# Altium schematic sheet 04-ModuleControls.SchDoc
size A
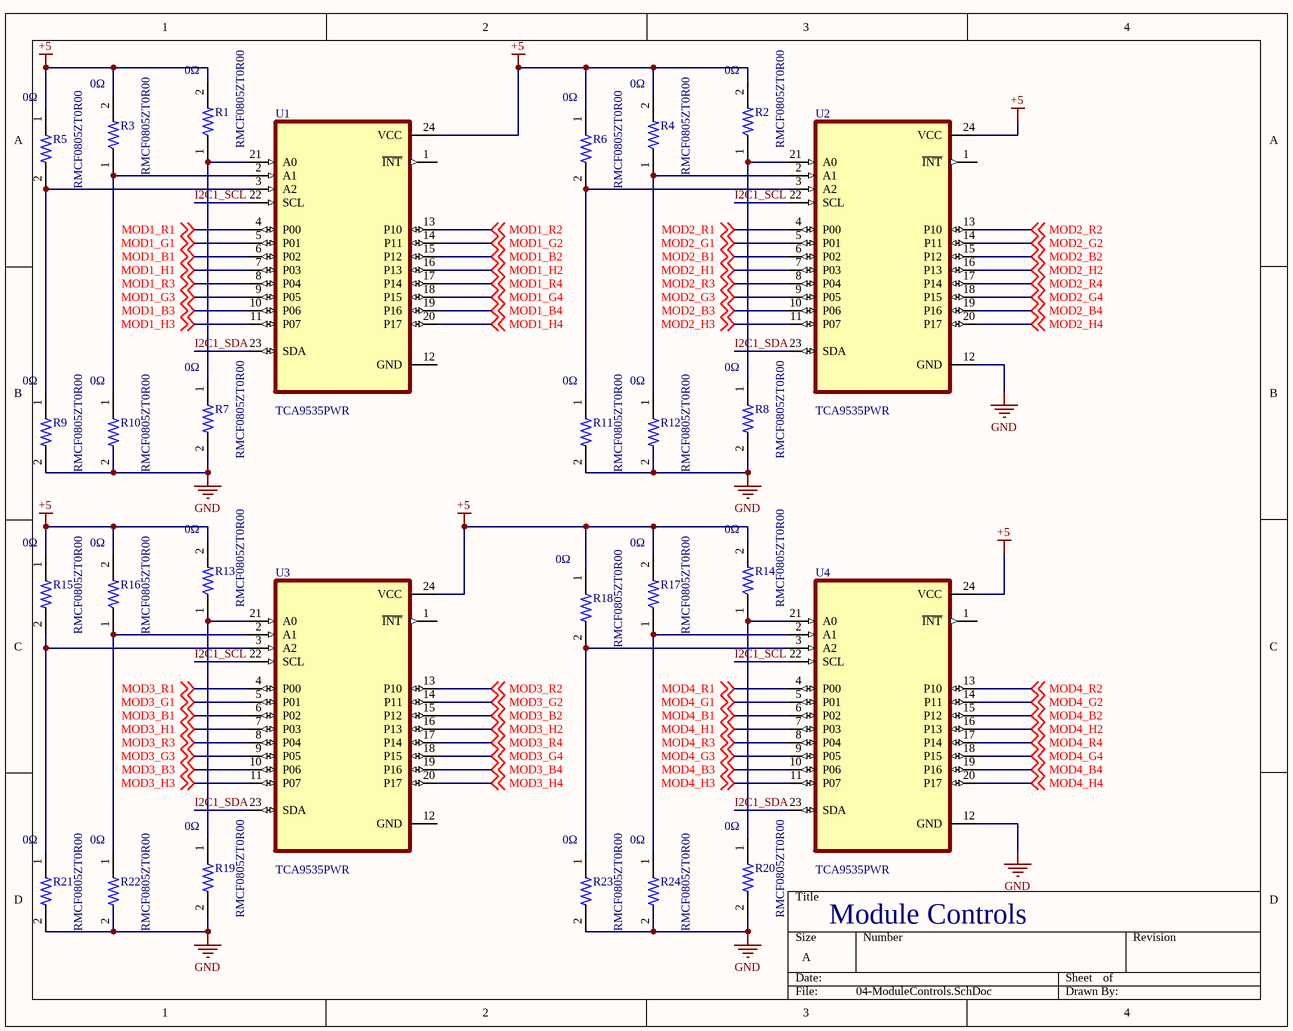
[diagram p0: 04-ModuleControls.SchDoc]

## Parts
R1  RMCF0805ZT0R00  Resitance: 0Ω  [RESC2012X60N]
R2  RMCF0805ZT0R00  Resitance: 0Ω  [RESC2012X60N]
R3  RMCF0805ZT0R00  Resitance: 0Ω  [RESC2012X60N]
R4  RMCF0805ZT0R00  Resitance: 0Ω  [RESC2012X60N]
R5  RMCF0805ZT0R00  Resitance: 0Ω  [RESC2012X60N]
R6  RMCF0805ZT0R00  Resitance: 0Ω  [RESC2012X60N]
R7  RMCF0805ZT0R00  Resitance: 0Ω  [RESC2012X60N]
R8  RMCF0805ZT0R00  Resitance: 0Ω  [RESC2012X60N]
R9  RMCF0805ZT0R00  Resitance: 0Ω  [RESC2012X60N]
R10  RMCF0805ZT0R00  Resitance: 0Ω  [RESC2012X60N]
R11  RMCF0805ZT0R00  Resitance: 0Ω  [RESC2012X60N]
R12  RMCF0805ZT0R00  Resitance: 0Ω  [RESC2012X60N]
R13  RMCF0805ZT0R00  Resitance: 0Ω  [RESC2012X60N]
R14  RMCF0805ZT0R00  Resitance: 0Ω  [RESC2012X60N]
R15  RMCF0805ZT0R00  Resitance: 0Ω  [RESC2012X60N]
R16  RMCF0805ZT0R00  Resitance: 0Ω  [RESC2012X60N]
R17  RMCF0805ZT0R00  Resitance: 0Ω  [RESC2012X60N]
R18  RMCF0805ZT0R00  Resitance: 0Ω  [RESC2012X60N]
R19  RMCF0805ZT0R00  Resitance: 0Ω  [RESC2012X60N]
R20  RMCF0805ZT0R00  Resitance: 0Ω  [RESC2012X60N]
R21  RMCF0805ZT0R00  Resitance: 0Ω  [RESC2012X60N]
R22  RMCF0805ZT0R00  Resitance: 0Ω  [RESC2012X60N]
R23  RMCF0805ZT0R00  Resitance: 0Ω  [RESC2012X60N]
R24  RMCF0805ZT0R00  Resitance: 0Ω  [RESC2012X60N]
U1  TCA9535PWR  [SOP65P640X120-24N]
U2  TCA9535PWR  [SOP65P640X120-24N]
U3  TCA9535PWR  [SOP65P640X120-24N]
U4  TCA9535PWR  [SOP65P640X120-24N]

## Nets
+5: R1.2 R2.2 R3.2 R4.2 R5.1 R6.1 R13.2 R14.2 R15.1 R16.2 R17.2 R18.1 U1.24(VCC) U2.24(VCC) U3.24(VCC) U4.24(VCC)
GND: R7.2 R8.2 R9.2 R10.2 R11.2 R12.2 R19.2 R20.2 R21.2 R22.2 R23.2 R24.2 U2.12(GND) U4.12(GND)
I2C1_SCL: U1.22(SCL) U2.22(SCL) U3.22(SCL) U4.22(SCL)
I2C1_SDA: U1.23(SDA) U2.23(SDA) U3.23(SDA) U4.23(SDA)
MOD1_B1: U1.6(P02) ; off-sheet MOD1_B1
MOD1_B2: U1.15(P12) ; off-sheet MOD1_B2
MOD1_B3: U1.10(P06) ; off-sheet MOD1_B3
MOD1_B4: U1.19(P16) ; off-sheet MOD1_B4
MOD1_G1: U1.5(P01) ; off-sheet MOD1_G1
MOD1_G2: U1.14(P11) ; off-sheet MOD1_G2
MOD1_G3: U1.9(P05) ; off-sheet MOD1_G3
MOD1_G4: U1.18(P15) ; off-sheet MOD1_G4
MOD1_H1: U1.7(P03) ; off-sheet MOD1_H1
MOD1_H2: U1.16(P13) ; off-sheet MOD1_H2
MOD1_H3: U1.11(P07) ; off-sheet MOD1_H3
MOD1_H4: U1.20(P17) ; off-sheet MOD1_H4
MOD1_R1: U1.4(P00) ; off-sheet MOD1_R1
MOD1_R2: U1.13(P10) ; off-sheet MOD1_R2
MOD1_R3: U1.8(P04) ; off-sheet MOD1_R3
MOD1_R4: U1.17(P14) ; off-sheet MOD1_R4
MOD2_B1: U2.6(P02) ; off-sheet MOD2_B1
MOD2_B2: U2.15(P12) ; off-sheet MOD2_B2
MOD2_B3: U2.10(P06) ; off-sheet MOD2_B3
MOD2_B4: U2.19(P16) ; off-sheet MOD2_B4
MOD2_G1: U2.5(P01) ; off-sheet MOD2_G1
MOD2_G2: U2.14(P11) ; off-sheet MOD2_G2
MOD2_G3: U2.9(P05) ; off-sheet MOD2_G3
MOD2_G4: U2.18(P15) ; off-sheet MOD2_G4
MOD2_H1: U2.7(P03) ; off-sheet MOD2_H1
MOD2_H2: U2.16(P13) ; off-sheet MOD2_H2
MOD2_H3: U2.11(P07) ; off-sheet MOD2_H3
MOD2_H4: U2.20(P17) ; off-sheet MOD2_H4
MOD2_R1: U2.4(P00) ; off-sheet MOD2_R1
MOD2_R2: U2.13(P10) ; off-sheet MOD2_R2
MOD2_R3: U2.8(P04) ; off-sheet MOD2_R3
MOD2_R4: U2.17(P14) ; off-sheet MOD2_R4
MOD3_B1: U3.6(P02) ; off-sheet MOD3_B1
MOD3_B2: U3.15(P12) ; off-sheet MOD3_B2
MOD3_B3: U3.10(P06) ; off-sheet MOD3_B3
MOD3_B4: U3.19(P16) ; off-sheet MOD3_B4
MOD3_G1: U3.5(P01) ; off-sheet MOD3_G1
MOD3_G2: U3.14(P11) ; off-sheet MOD3_G2
MOD3_G3: U3.9(P05) ; off-sheet MOD3_G3
MOD3_G4: U3.18(P15) ; off-sheet MOD3_G4
MOD3_H1: U3.7(P03) ; off-sheet MOD3_H1
MOD3_H2: U3.16(P13) ; off-sheet MOD3_H2
MOD3_H3: U3.11(P07) ; off-sheet MOD3_H3
MOD3_H4: U3.20(P17) ; off-sheet MOD3_H4
MOD3_R1: U3.4(P00) ; off-sheet MOD3_R1
MOD3_R2: U3.13(P10) ; off-sheet MOD3_R2
MOD3_R3: U3.8(P04) ; off-sheet MOD3_R3
MOD3_R4: U3.17(P14) ; off-sheet MOD3_R4
MOD4_B1: U4.6(P02) ; off-sheet MOD4_B1
MOD4_B2: U4.15(P12) ; off-sheet MOD4_B2
MOD4_B3: U4.10(P06) ; off-sheet MOD4_B3
MOD4_B4: U4.19(P16) ; off-sheet MOD4_B4
MOD4_G1: U4.5(P01) ; off-sheet MOD4_G1
MOD4_G2: U4.14(P11) ; off-sheet MOD4_G2
MOD4_G3: U4.9(P05) ; off-sheet MOD4_G3
MOD4_G4: U4.18(P15) ; off-sheet MOD4_G4
MOD4_H1: U4.7(P03) ; off-sheet MOD4_H1
MOD4_H2: U4.16(P13) ; off-sheet MOD4_H2
MOD4_H3: U4.11(P07) ; off-sheet MOD4_H3
MOD4_H4: U4.20(P17) ; off-sheet MOD4_H4
MOD4_R1: U4.4(P00) ; off-sheet MOD4_R1
MOD4_R2: U4.13(P10) ; off-sheet MOD4_R2
MOD4_R3: U4.8(P04) ; off-sheet MOD4_R3
MOD4_R4: U4.17(P14) ; off-sheet MOD4_R4
NetR1_1: R1.1 R7.1 U1.21(A0)
NetR2_1: R2.1 R8.1 U2.21(A0)
NetR3_1: R3.1 R10.1 U1.2(A1)
NetR4_1: R4.1 R12.1 U2.2(A1)
NetR5_2: R5.2 R9.1 U1.3(A2)
NetR6_2: R6.2 R11.1 U2.3(A2)
NetR13_1: R13.1 R19.1 U3.21(A0)
NetR14_1: R14.1 R20.1 U4.21(A0)
NetR15_2: R15.2 R21.1 U3.3(A2)
NetR16_1: R16.1 R22.1 U3.2(A1)
NetR17_1: R17.1 R24.1 U4.2(A1)
NetR18_2: R18.2 R23.1 U4.3(A2)

Not connected (* = marked no-connect by the designer): U1 1(~{INT}) 12(GND); U2 1(~{INT}); U3 1(~{INT}) 12(GND); U4 1(~{INT})

## Notes on the sheet
- Module Controls

## Library data of the parts
R1-R24 = RMCF0805ZT0R00: 0 Ohms Jumper 0.125W, 1/8W Chip Resistor 0805 (2012 Metric) Automotive AEC-Q200 Thick Film; MF: Stackpole Electronics; DigiKey-Purchase-URL: https://snapeda.com/shop?store=DigiKey&id=492501; Package: 0805 Stackpole Electronics; Availability: Unavailable; MP: RMCF0805ZT0R00; SnapEDA_Link: https://www.snapeda.com/parts/RMCF0805ZT0R00/Stackpole%20Electronics%20Inc/view-part/492501/?ref=snap; Price: None; Parameter 1: *
U1-U4 = TCA9535PWR: Remote 16-Bit I2C and SMBus, Low-Power I/O Expander With Interrupt Output and Config Registers 24-TSSOP -40 to 85; MF: Texas Instruments; Texas_Instruments-Purchase-URL: https://snapeda.com/shop?store=Texas+Instruments&id=1237891; SnapEDA_Link: https://www.snapeda.com/parts/TCA9535PWR/Texas%20Instruments/view-part/1237891/?ref=snap; Availability: Good; Price: None; MP: TCA9535PWR; DigiKey-Purchase-URL: https://snapeda.com/shop?store=DigiKey&id=1237891; Package: TSSOP-24 Texas Instruments; Mouser-Purchase-URL: https://snapeda.com/shop?store=Mouser&id=1237891; Arrow_Electronics-Purchase-URL: https://snapeda.com/shop?store=Arrow+Electronics&id=1237891; Value: *